# EAGLE design tick-wifi-mini-mk-1.3 (EAGLE 7.5.0)
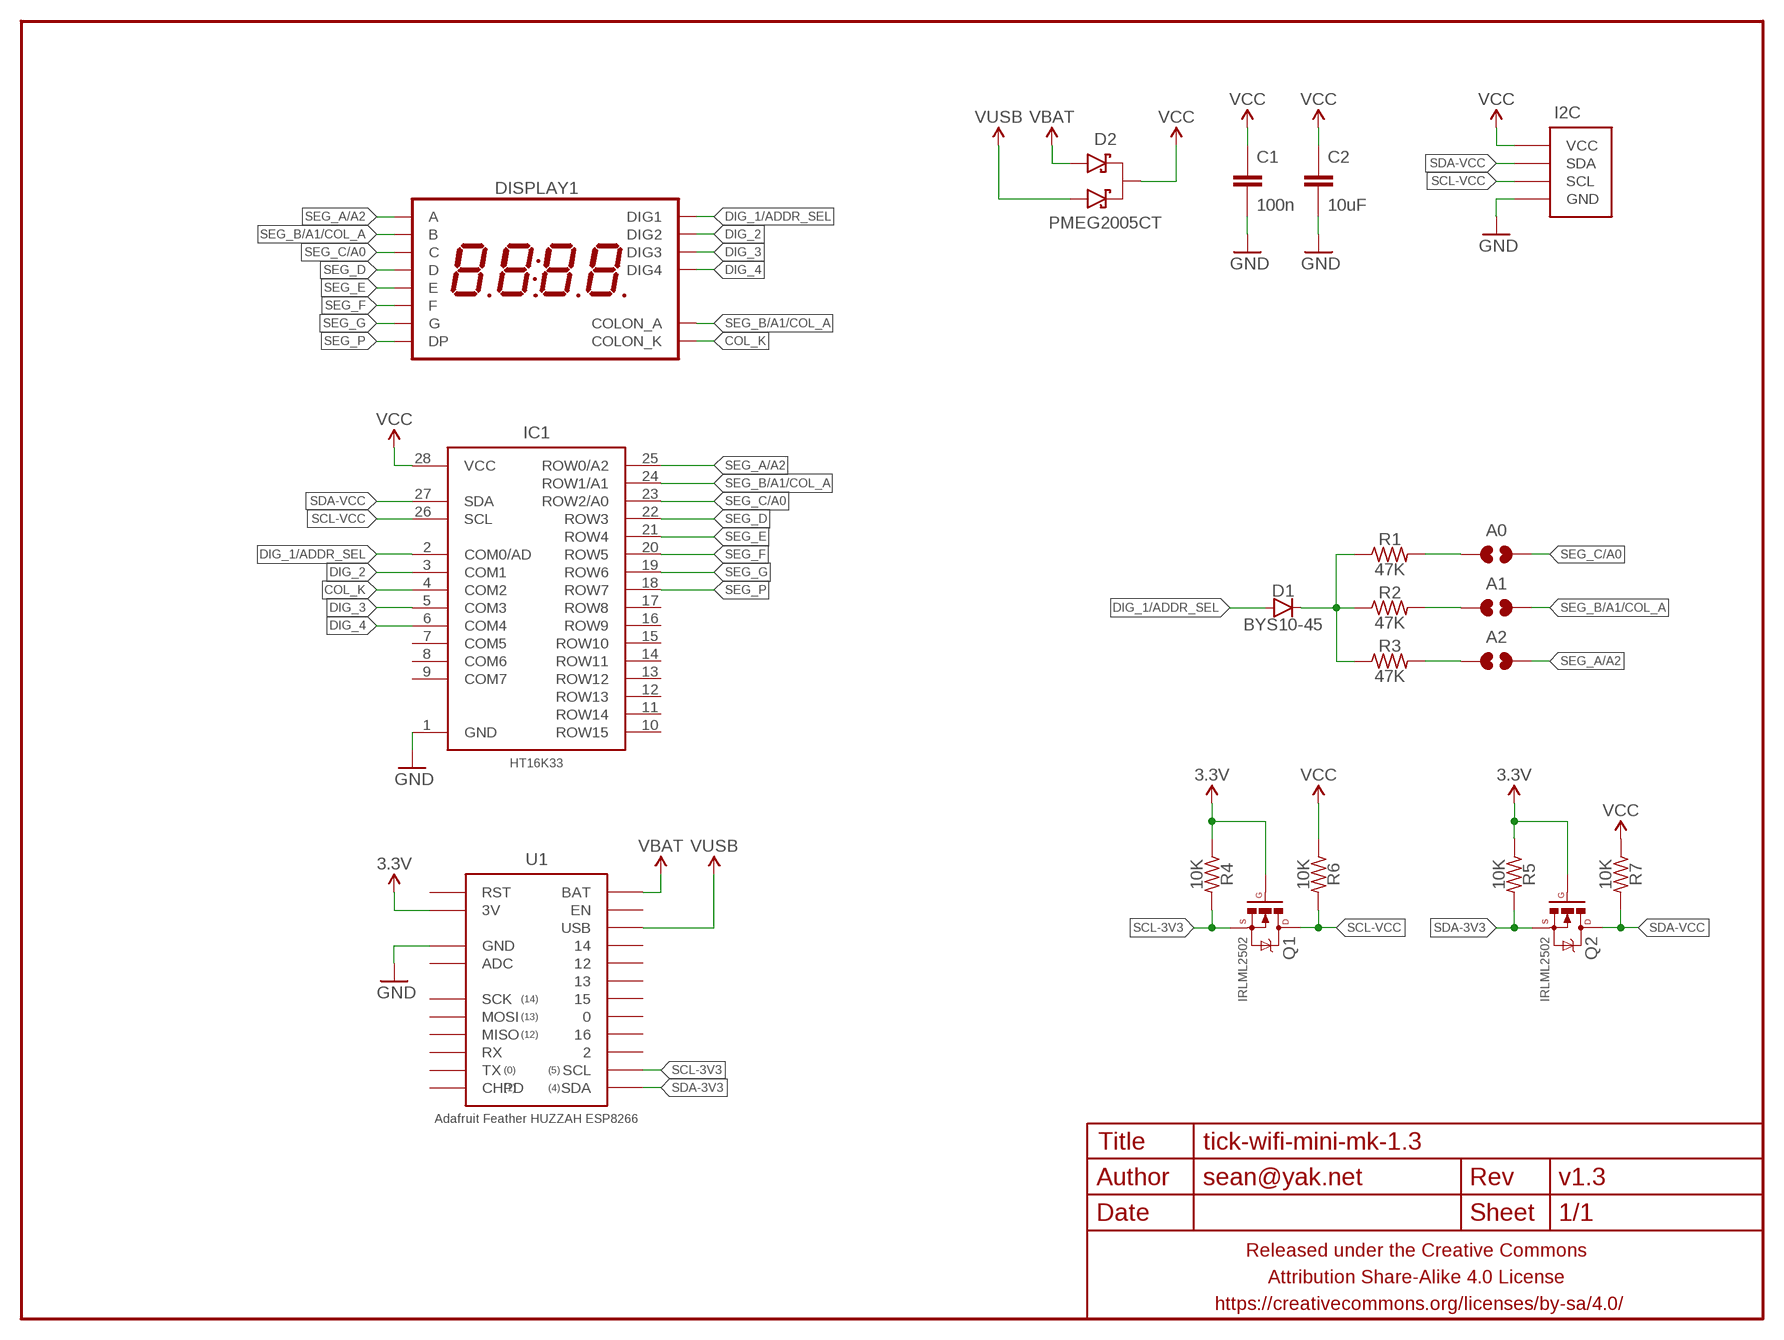
[diagram p0: schematic, sheet 1]

## Parts
A0  JUMPER-PAD-2-NOYES_SILK  [PAD-JUMPER-2-NO_YES_SILK]
A1  JUMPER-PAD-2-NOYES_SILK  [PAD-JUMPER-2-NO_YES_SILK]
A2  JUMPER-PAD-2-NOYES_SILK  [PAD-JUMPER-2-NO_YES_SILK]
C1  100n  CAPACITOR-CERAMICC0603-TIGHTER  [C0603-TIGHTER]
C2  10uF  CAPACITOR-CERAMICC0805-TIGHTER  [C0805-TIGHTER]
D1  BYS10-45  DIODESOD  [SOD323]
D2  PMEG2005CT  DIODE-SCHOTTKY-DUALPMEG2005CT  [SOT23]
DISPLAY1  7SEG_4DIGIT_COLON14.2MM-CC  [7SEG_4DIG_0.56IN_14MM_ADAFRUIT]
FRAME1  FRAME-LETTERNO_PACKAGE  [DUMMY]
I2C  M04-I2CPTH-2MM-CENTERED  [1X04-2MM-CENTERED-I2C]
IC1  HT16K33  HT16K33-28SOIC28W  [SOIC28W]
Q1  IRLML2502  MOSFET-NCHANNELIRLML2502  [SOT23]
Q2  IRLML2502  MOSFET-NCHANNELIRLML2502  [SOT23]
R1  47K  RESISTORR0603-TIGHTER  [R0603-TIGHTER]
R2  47K  RESISTORR0603-TIGHTER  [R0603-TIGHTER]
R3  47K  RESISTORR0603-TIGHTER  [R0603-TIGHTER]
R4  10K  RESISTORR0603-TIGHTER  [R0603-TIGHTER]
R5  10K  RESISTORR0603-TIGHTER  [R0603-TIGHTER]
R6  10K  RESISTORR0603-TIGHTER  [R0603-TIGHTER]
R7  10K  RESISTORR0603-TIGHTER  [R0603-TIGHTER]
U1  Adafruit Feather HUZZAH ESP8266  ADAFRUIT_FEATHER_HUZZAH_ESP8266NOSILK  [ADAFRUIT_FEATHER_HUZZAH_NOSILK]

## Nets
3.3V: Q1.1(G) Q2.1(G) R4.1 R5.1 U1.3V
COL_K: DISPLAY1.P$7(COLON_K) IC1.4(COM2)
DIG_1/ADDR_SEL: D1.A DISPLAY1.P$14(DIG1) IC1.2(COM0/AD)
DIG_2: DISPLAY1.P$11(DIG2) IC1.3(COM1)
DIG_3: DISPLAY1.P$10(DIG3) IC1.5(COM3)
DIG_4: DISPLAY1.P$6(DIG4) IC1.6(COM4)
GND: C1.2 C2.2 I2C.1(GND) IC1.1(GND) U1.GND@0(GND)
N$1: D1.C R1.1 R2.1 R3.1
N$2: A0.1 R1.2
N$3: A1.1 R2.2
N$4: A2.1 R3.2
SCL-3V3: Q1.2(S) R4.2 U1.SCL
SCL-VCC: I2C.4(SCL) IC1.26(SCL) Q1.3(D) R6.2
SDA-3V3: Q2.2(S) R5.2 U1.SDA
SDA-VCC: I2C.3(SDA) IC1.27(SDA) Q2.3(D) R7.2
SEG_A/A2: A2.2 DISPLAY1.P$13(A) IC1.25(ROW0/A2)
SEG_B/A1/COL_A: A1.2 DISPLAY1.P$8(COLON_A) DISPLAY1.P$9(B) IC1.24(ROW1/A1)
SEG_C/A0: A0.2 DISPLAY1.P$4(C) IC1.23(ROW2/A0)
SEG_D: DISPLAY1.P$2(D) IC1.22(ROW3)
SEG_E: DISPLAY1.P$1(E) IC1.21(ROW4)
SEG_F: DISPLAY1.P$12(F) IC1.20(ROW5)
SEG_G: DISPLAY1.P$5(G) IC1.19(ROW6)
SEG_P: DISPLAY1.P$3(DP) IC1.18(ROW7)
VBAT: D2.1(A1) U1.BAT
VCC: C1.1 C2.1 D2.3(K) I2C.2(VCC) IC1.28(VCC) R6.1 R7.1
VUSB: D2.2(A2) U1.USB
Unconnected: IC1.7(COM5) IC1.8(COM6) IC1.9(COM7) IC1.10(ROW15) IC1.11(ROW14) IC1.12(ROW13) IC1.13(ROW12) IC1.14(ROW11) IC1.15(ROW10) IC1.16(ROW9) IC1.17(ROW8) U1.0 U1.2 U1.12 U1.13 U1.14 U1.15 U1.16 U1.ADC U1.CHPD U1.EN U1.MISO U1.MOSI U1.RST U1.RX U1.SCK U1.TX

## Library data of the parts
A0 A1 A2 = a_parts:JUMPER-PAD-2-NO
C1 C2 = a_parts:CAPACITOR-CERAMIC: CAPACITOR, European symbol
D1 = a_parts:DIODE: Diode These are standard reverse protection diodes and small signal diodes. SMA package can handle up to about 1A. SOD-323 can handle about 200mA. What the SOD-323 package when ordering, there are some mfgs out there that are 5-pin packages.; PROD_ID: DIO-09646
D2 = a_parts:DIODE-SCHOTTKY-DUAL
DISPLAY1 = a_parts:7SEG_4DIGIT_COLON
FRAME1 = A_butts:FRAME-LETTER: Schematic Frame Standard 8.5x11 US Letter frame; DESIGNER: sean@yak.net; VERSION: v1.3
I2C = a_parts:M04-I2C
IC1 = a_parts:HT16K33-28
Q1 Q2 = a_parts:MOSFET-NCHANNEL: Common NMOSFET Parts MFG P/N Store ID Prod ID FDD8780 TRANS-09984 SI7820DN TRANS-11055 FDS6630A IC-08089 2N7002PW TRANS-11151 FQP30N06L COM-10213 TRANS-10060 BSS123LT1G TRANS-08345 BSS138 TRANS-00830 BS170 2N7000
R1-R7 = a_parts:RESISTOR: RESISTOR, American symbol
U1 = a_parts:ADAFRUIT_FEATHER_HUZZAH_ESP8266

## Board
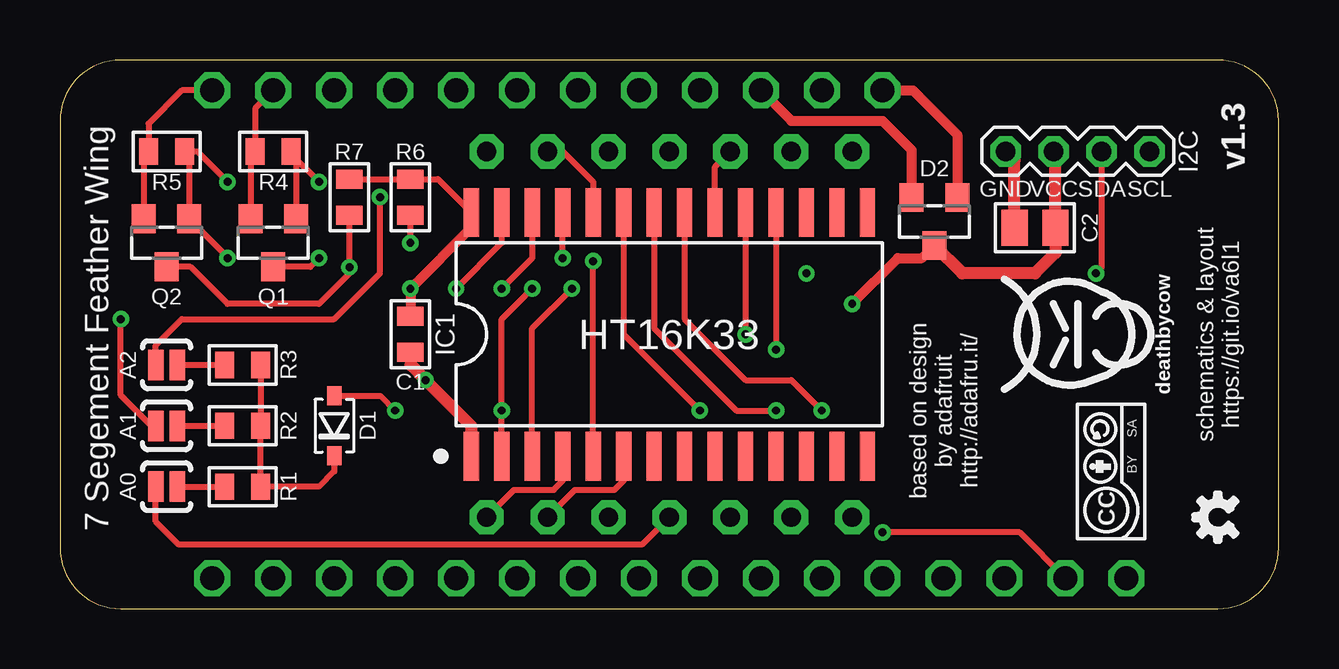
[diagram p1: board, top side]
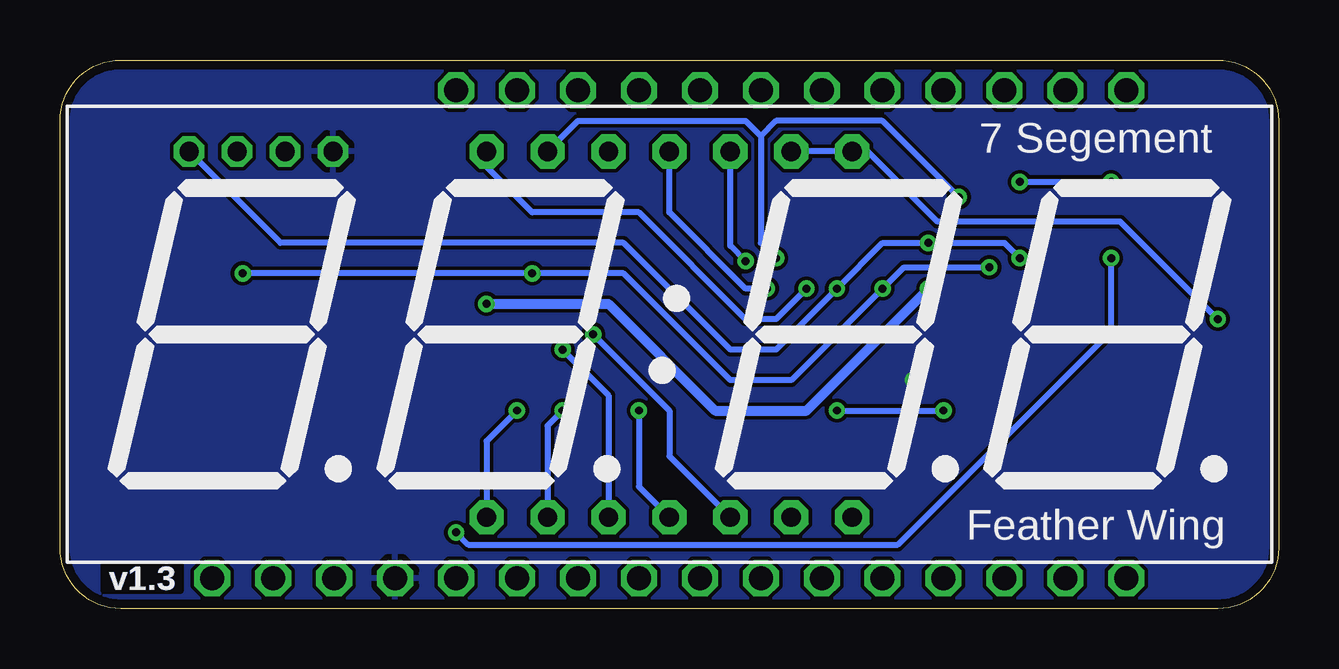
[diagram p2: board, bottom side, seen from below]

Size 50.8 x 22.86 mm. Coordinates in mm from the lower left corner, seen from the top.
Outline: 50.8,2.54 50.8,20.32 arc90 48.26,22.86 2.54,22.86 arc90 0,20.32 0,2.54 arc90 2.54,0 48.26,0 arc90 50.8,2.54
Copper layers (1*16): Top 0.0356mm / dielectric 1.5011mm / Bottom 0.0356mm
Design rules "LaenPCBOrder_2": minimum track width 6mil, minimum drill 13mil, track to track 6mil, track to pad 6mil, pad to pad 6mil, via to via 6mil, smd to smd 6mil, copper to edge 15mil, drill to drill 6mil, minimum pad ring 7mil, minimum via ring 7mil, stop-mask expansion 3mil, vias tented up to drill 20mil, thermal gap 10mil

### Footprints (pad centres in the part's own frame; a part is rotated, then mirrored left to right if it is on the bottom)
PAD-JUMPER-2-NO_YES_SILK = smd 0.635 x 1.27: 1 -0.45,0; 2 0.45,0
C0603-TIGHTER = smd 0.8 x 1.1: 1 -0.75,0; 2 0.75,0
C0805-TIGHTER = smd 1.1 x 1.5: 1 -0.85,0; 2 0.85,0
SOD323 = smd 0.8 x 0.6: A -1.25,0; C 1.25,0
SOT23 = smd 1 x 1.2: 1 -0.95,-1; 2 0.95,-1; 3 0,1
7SEG_4DIG_0.56IN_14MM_ADAFRUIT = drill 0.8 pad 1.422 octagon: P$1 -7.62,-7.62; P$2 -5.08,-7.62; P$3 -2.54,-7.62; P$4 0,-7.62; P$5 2.54,-7.62; P$6 5.08,-7.62; P$7 7.62,-7.62; P$8 7.62,7.62; P$9 5.08,7.62; P$10 2.54,7.62; P$11 0,7.62; P$12 -2.54,7.62; P$13 -5.08,7.62; P$14 -7.62,7.62
1X04-2MM-CENTERED-I2C = drill 0.8 pad 1.27 octagon: 1 -3,0; 2 -1,0; 3 1,0; 4 3,0
SOIC28W = smd 0.635 x 2.032: 1 -8.255,-5.08; 2 -6.985,-5.08; 3 -5.715,-5.08; 4 -4.445,-5.08; 5 -3.175,-5.08; 6 -1.905,-5.08; 7 -0.635,-5.08; 8 0.635,-5.08; 9 1.905,-5.08; 10 3.175,-5.08; 11 4.445,-5.08; 12 5.715,-5.08; 13 6.985,-5.08; 14 8.255,-5.08; 15 8.255,5.08; 16 6.985,5.08; 17 5.715,5.08; 18 4.445,5.08; 19 3.175,5.08; 20 1.905,5.08; 21 0.635,5.08; 22 -0.635,5.08; 23 -1.905,5.08; 24 -3.175,5.08; 25 -4.445,5.08; 26 -5.715,5.08; 27 -6.985,5.08; 28 -8.255,5.08
R0603-TIGHTER = smd 0.8 x 1.1: 1 -0.75,0; 2 0.75,0
ADAFRUIT_FEATHER_HUZZAH_NOSILK = drill 1 pad 1.5 octagon: 0 8.89,10.16; 2 13.97,10.16; 3V -16.51,-10.16; 12 1.27,10.16; 13 3.81,10.16; 14 -1.27,10.16; 15 6.35,10.16; 16 11.43,10.16; ADC -8.89,-10.16; BAT -8.89,10.16; CHPD 19.05,-10.16; EN -6.35,10.16; GND@0 -11.43,-10.16; MISO 11.43,-10.16; MOSI 8.89,-10.16; NC@3 -13.97,-10.16; NC@6 -6.35,-10.16; NC@7 -3.81,-10.16; NC@8 -1.27,-10.16; NC@9 1.27,-10.16; NC@10 3.81,-10.16; RST -19.05,-10.16; RX 13.97,-10.16; SCK 6.35,-10.16; SCL 16.51,10.16; SDA 19.05,10.16; TX 16.51,-10.16; USB -3.81,10.16

### Placement (x,y rotation side)
A0  4.45,5.08 180 top
A1  4.45,7.62 180 top
A2  4.45,10.16 180 top
C1  14.61,11.43 270 top
C2  40.64,15.88 180 top
D1  11.43,7.62 270 top
D2  36.45,16.13 180 top
DISPLAY1  25.4,11.43 0 bottom
FRAME1  0,0 0 top
I2C  42.42,19.05 0 top
IC1  25.4,11.43 0 top
Q1  8.89,15.24 180 top
Q2  4.45,15.24 180 top
R1  7.62,5.08 180 top
R2  7.62,7.62 180 top
R3  7.62,10.16 180 top
R4  8.89,19.05 180 top
R5  4.45,19.05 180 top
R6  14.61,17.14 270 top
R7  12.06,17.14 270 top
U1  25.4,11.43 0 bottom
U$2  [COW_SMALL]  41.91,11.43 90 top
U$3  [OSHWLOGO_TINY_SILKONLY]  48.26,3.81 90 top
U$4  [CC-BY-SA-4.0-NO-URL]  43.81,5.71 90 top

### Tracks (layer width: path | path; a pad name or v marks a point on that pad's centre or on a via)
3.3V  (via drill 0.33)
  Top 0.254: U1.3V 40.01,3.17 v34.29,3.17 | v6.99,14.61 6.99,14.65 Q2.1 5.39,18.85 R5.1 5.71,19.05 v6.99,17.78 | Q1.1 9.84,18.85 R4.1 9.64,18.93 v10.79,17.78
  Bottom 0.254: v34.29,3.17 33.78,2.67 15.88,2.67 6.99,11.56 v6.99,14.61 | v10.79,17.78 v6.99,17.78
COL_K
  Top 0.254: DISPLAY1.P$7 18.92,4.95 20.57,4.95 20.95,5.33 IC1.4
DIG_1/ADDR_SEL  (via drill 0.33)
  Top 0.254: IC1.2 v18.41,8.26 18.41,12.06 v19.68,13.34 | D1.A 13.36,8.87 v13.97,8.26
  Bottom 0.254: v19.68,13.34 20.95,12.06 22.23,12.06 26.67,16.51 31.11,16.51 33.02,18.41 DISPLAY1.P$14 | v18.41,8.26 v13.97,8.26
DIG_2  (via drill 0.33)
  Top 0.254: IC1.3 19.68,11.68 v21.34,13.34
  Bottom 0.254: v21.34,13.34 22.23,13.34 25.4,16.51 DISPLAY1.P$11
DIG_3  (via drill 0.33)
  Top 0.254: IC1.5 v22.23,14.48
  Bottom 0.254: v22.23,14.48 22.86,15.11 DISPLAY1.P$10
DIG_4
  Top 0.254: DISPLAY1.P$6 21.46,4.95 23.11,4.95 23.5,5.33 IC1.6
GND  (via drill 0.33)
  Top 0.508: C1.2 14.61,10.16 v15.24,9.53 17.14,7.62 IC1.1 | C2.2 39.79,18.68 I2C.1
  pour Bottom: 0,0 0,22.86 50.8,22.86 50.8,0
N$1
  Top 0.254: R3.1 R2.1 R1.1 10.79,5.08 11.43,5.71 D1.C
N$2
  Top 0.254: A0.1 R1.2
N$3
  Top 0.254: A1.1 R2.2
N$4
  Top 0.254: A2.1 R3.2
SCL-3V3
  Top 0.254: Q1.2 7.94,18.85 R4.2 8.14,20.84 U1.SCL
SCL-VCC  (via drill 0.33)
  Top 0.254: IC1.26 19.68,14.61 v18.41,13.34 | v14.61,15.24 R6.2 | v10.79,14.61 10.43,14.24 Q1.3
  Bottom 0.254: v10.79,14.61 11.43,15.24 v14.61,15.24 16.51,15.24 v18.41,13.34 20.95,10.79 22.86,10.79 27.3,15.24 41.61,15.24 I2C.4
SDA-3V3
  Top 0.254: Q2.2 3.5,18.85 R5.2 3.69,20.2 5.08,21.59 U1.SDA
SDA-VCC  (via drill 0.33)
  Top 0.254: IC1.27 18.41,15.24 v16.51,13.34 | R7.2 v12.06,14.22 12.06,13.97 10.79,12.7 6.99,12.7 5.45,14.24 Q2.3 | v43.18,13.97 43.42,14.21 I2C.3
  Bottom 0.254: v12.06,14.22 15.62,14.22 v16.51,13.34 20.32,9.53 22.86,9.53 27.3,13.97 v31.11,13.97 v43.18,13.97
SEG_A/A2  (via drill 0.33)
  Top 0.254: v20.95,14.61 IC1.25 | A2.2 4,10.98 5.08,12.06 11.43,12.06 13.34,13.97 v13.34,17.14
  Bottom 0.254: DISPLAY1.P$13 29.21,20.32 22.23,20.32 21.59,19.68 | 21.59,19.68 21.59,15.24 v20.95,14.61 | v13.34,17.14 16.51,20.32 20.95,20.32 21.59,19.68
SEG_B/A1/COL_A  (via drill 0.33)
  Top 0.254: DISPLAY1.P$9 20.95,19.05 22.23,17.78 IC1.24 | A1.2 3.81,7.62 2.54,8.89 v2.54,12.06
  Bottom 0.254: DISPLAY1.P$9 DISPLAY1.P$8 17.14,19.05 14.22,16.13 6.6,16.13 v2.54,12.06
SEG_C/A0  (via drill 0.33)
  Top 0.254: DISPLAY1.P$4 24.26,2.67 4.95,2.67 4,3.62 A0.2 | IC1.23 23.5,11.43 v26.67,8.26
  Bottom 0.254: v26.67,8.26 26.67,5.08 DISPLAY1.P$4
SEG_D  (via drill 0.33)
  Top 0.254: IC1.22 24.77,11.68 28.19,8.26 v29.84,8.26
  Bottom 0.254: v29.84,8.26 30.48,7.62 DISPLAY1.P$2
SEG_E  (via drill 0.33)
  Top 0.254: IC1.21 26.04,12.06 28.57,9.53 30.48,9.53 v31.75,8.26
  Bottom 0.254: v31.75,8.26 33.02,6.99 DISPLAY1.P$1
SEG_F
  Top 0.254: IC1.20 27.3,18.41 DISPLAY1.P$12
SEG_G  (via drill 0.33)
  Top 0.254: IC1.19 v28.57,11.43
  Bottom 0.254: DISPLAY1.P$5 25.4,6.35 25.4,8.26 v28.57,11.43
SEG_P  (via drill 0.33)
  Top 0.254: IC1.18 v29.84,10.79
  Bottom 0.254: v29.84,10.79 27.94,8.89 DISPLAY1.P$3
VBAT
  Top 0.406: U1.BAT 35.56,21.59 37.4,19.75 D2.1
VCC  (via drill 0.33)
  Top 0.254: R7.1 R6.1 15.76,17.89 IC1.28
  Top 0.406: C1.1 v14.61,13.34 17.14,15.88 IC1.28 | v33.02,12.7 34.92,14.61 35.92,14.61 D2.3
  Top 0.508: I2C.2 41.49,18.98 C2.1 41.49,14.82 40.64,13.97 37.61,13.97 D2.3
  Bottom 0.406: v33.02,12.7 27.94,12.7 23.5,8.26 19.68,8.26 v14.61,13.34
VUSB
  Top 0.406: U1.USB 30.48,20.32 34.29,20.32 35.5,19.11 D2.2

### Text on the board
tPlace: 7 Segement Feather Wing | schematics & layout / https://git.io/va6l1 | based on design / by adafruit / http://adafru.it/
bPlace: 7 Segement | Feather Wing